# EAGLE design matrix mixer rev02 7eurorack (EAGLE 8.3.2)
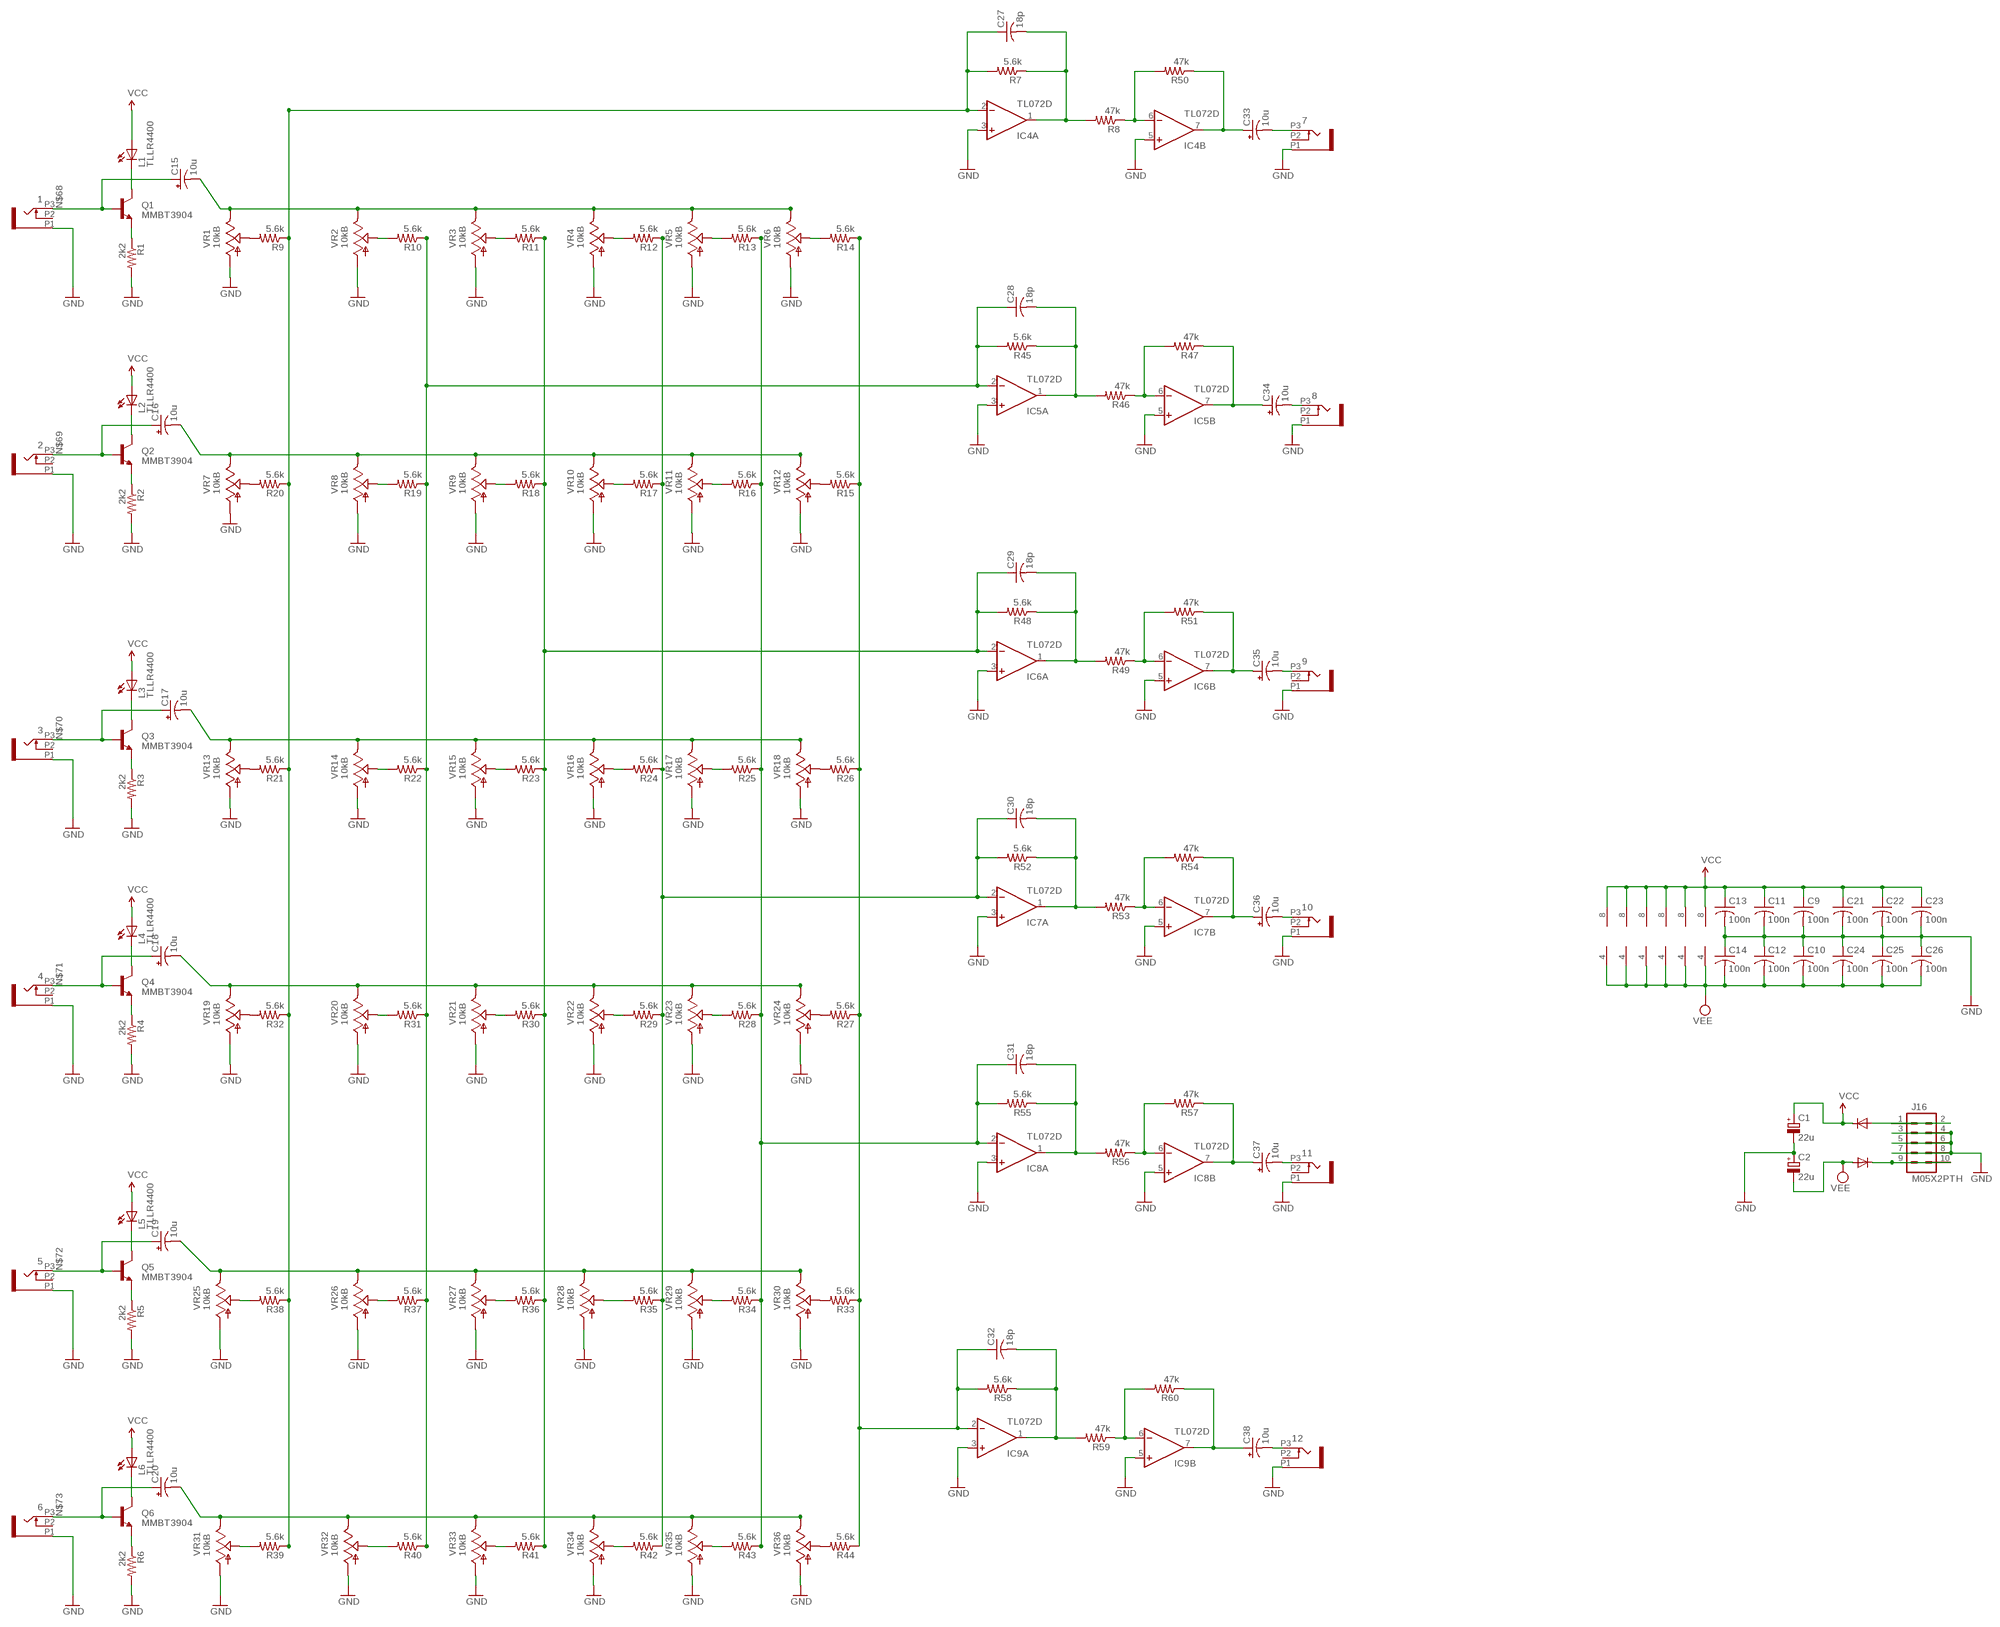
[diagram p0: schematic, sheet 1]

## Parts
1  PJ301_THONKICONN6  [WQP_PJ_301M6]
2  PJ301_THONKICONN6  [WQP_PJ_301M6]
3  PJ301_THONKICONN6  [WQP_PJ_301M6]
4  PJ301_THONKICONN6  [WQP_PJ_301M6]
5  PJ301_THONKICONN6  [WQP_PJ_301M6]
6  PJ301_THONKICONN6  [WQP_PJ_301M6]
7  PJ301_THONKICONN6  [WQP_PJ_301M6]
8  PJ301_THONKICONN6  [WQP_PJ_301M6]
9  PJ301_THONKICONN6  [WQP_PJ_301M6]
10  PJ301_THONKICONN6  [WQP_PJ_301M6]
11  PJ301_THONKICONN6  [WQP_PJ_301M6]
12  PJ301_THONKICONN6  [WQP_PJ_301M6]
C1  22u  CPOL-EUD  [PANASONIC_D]
C2  22u  CPOL-EUD  [PANASONIC_D]
C9  100n  C-USC0603  [C0603]
C10  100n  C-USC0603  [C0603]
C11  100n  C-USC0603  [C0603]
C12  100n  C-USC0603  [C0603]
C13  100n  C-USC0603  [C0603]
C14  100n  C-USC0603  [C0603]
C15  10u  CPOL-USB  [PANASONIC_B]
C16  10u  CPOL-USB  [PANASONIC_B]
C17  10u  CPOL-USB  [PANASONIC_B]
C18  10u  CPOL-USB  [PANASONIC_B]
C19  10u  CPOL-USB  [PANASONIC_B]
C20  10u  CPOL-USB  [PANASONIC_B]
C21  100n  C-USC0603  [C0603]
C22  100n  C-USC0603  [C0603]
C23  100n  C-USC0603  [C0603]
C24  100n  C-USC0603  [C0603]
C25  100n  C-USC0603  [C0603]
C26  100n  C-USC0603  [C0603]
C27  18p  C-USC0603  [C0603]
C28  18p  C-USC0603  [C0603]
C29  18p  C-USC0603  [C0603]
C30  18p  C-USC0603  [C0603]
C31  18p  C-USC0603  [C0603]
C32  18p  C-USC0603  [C0603]
C33  10u  CPOL-USB  [PANASONIC_B]
C34  10u  CPOL-USB  [PANASONIC_B]
C35  10u  CPOL-USB  [PANASONIC_B]
C36  10u  CPOL-USB  [PANASONIC_B]
C37  10u  CPOL-USB  [PANASONIC_B]
C38  10u  CPOL-USB  [PANASONIC_B]
D1  1N5819HW  DIODE-SOD123  [SOD123]
D2  1N5819HW  DIODE-SOD123  [SOD123]
IC4  TL072D  [SO08]
IC5  TL072D  [SO08]
IC6  TL072D  [SO08]
IC7  TL072D  [SO08]
IC8  TL072D  [SO08]
IC9  TL072D  [SO08]
J16  M05X2PTH  [AVR_ICSP]
L1  TLLR4400  [LED3MM]
L2  TLLR4400  [LED3MM]
L3  TLLR4400  [LED3MM]
L4  TLLR4400  [LED3MM]
L5  TLLR4400  [LED3MM]
L6  TLLR4400  [LED3MM]
Q1  MMBT3904  MMBT3904LT1-NPN-SOT23-BEC  [SOT23-BEC]
Q2  MMBT3904  MMBT3904LT1-NPN-SOT23-BEC  [SOT23-BEC]
Q3  MMBT3904  MMBT3904LT1-NPN-SOT23-BEC  [SOT23-BEC]
Q4  MMBT3904  MMBT3904LT1-NPN-SOT23-BEC  [SOT23-BEC]
Q5  MMBT3904  MMBT3904LT1-NPN-SOT23-BEC  [SOT23-BEC]
Q6  MMBT3904  MMBT3904LT1-NPN-SOT23-BEC  [SOT23-BEC]
R1  2k2  R-US_R0603  [R0603]
R2  2k2  R-US_R0603  [R0603]
R3  2k2  R-US_R0603  [R0603]
R4  2k2  R-US_R0603  [R0603]
R5  2k2  R-US_R0603  [R0603]
R6  2k2  R-US_R0603  [R0603]
R7  5.6k  R-US_R0603  [R0603]
R8  47k  R-US_R0603  [R0603]
R9  5.6k  R-US_R0603  [R0603]
R10  5.6k  R-US_R0603  [R0603]
R11  5.6k  R-US_R0603  [R0603]
R12  5.6k  R-US_R0603  [R0603]
R13  5.6k  R-US_R0603  [R0603]
R14  5.6k  R-US_R0603  [R0603]
R15  5.6k  R-US_R0603  [R0603]
R16  5.6k  R-US_R0603  [R0603]
R17  5.6k  R-US_R0603  [R0603]
R18  5.6k  R-US_R0603  [R0603]
R19  5.6k  R-US_R0603  [R0603]
R20  5.6k  R-US_R0603  [R0603]
R21  5.6k  R-US_R0603  [R0603]
R22  5.6k  R-US_R0603  [R0603]
R23  5.6k  R-US_R0603  [R0603]
R24  5.6k  R-US_R0603  [R0603]
R25  5.6k  R-US_R0603  [R0603]
R26  5.6k  R-US_R0603  [R0603]
R27  5.6k  R-US_R0603  [R0603]
R28  5.6k  R-US_R0603  [R0603]
R29  5.6k  R-US_R0603  [R0603]
R30  5.6k  R-US_R0603  [R0603]
R31  5.6k  R-US_R0603  [R0603]
R32  5.6k  R-US_R0603  [R0603]
R33  5.6k  R-US_R0603  [R0603]
R34  5.6k  R-US_R0603  [R0603]
R35  5.6k  R-US_R0603  [R0603]
R36  5.6k  R-US_R0603  [R0603]
R37  5.6k  R-US_R0603  [R0603]
R38  5.6k  R-US_R0603  [R0603]
R39  5.6k  R-US_R0603  [R0603]
R40  5.6k  R-US_R0603  [R0603]
R41  5.6k  R-US_R0603  [R0603]
R42  5.6k  R-US_R0603  [R0603]
R43  5.6k  R-US_R0603  [R0603]
R44  5.6k  R-US_R0603  [R0603]
R45  5.6k  R-US_R0603  [R0603]
R46  47k  R-US_R0603  [R0603]
R47  47k  R-US_R0603  [R0603]
R48  5.6k  R-US_R0603  [R0603]
R49  47k  R-US_R0603  [R0603]
R50  47k  R-US_R0603  [R0603]
R51  47k  R-US_R0603  [R0603]
R52  5.6k  R-US_R0603  [R0603]
R53  47k  R-US_R0603  [R0603]
R54  47k  R-US_R0603  [R0603]
R55  5.6k  R-US_R0603  [R0603]
R56  47k  R-US_R0603  [R0603]
R57  47k  R-US_R0603  [R0603]
R58  5.6k  R-US_R0603  [R0603]
R59  47k  R-US_R0603  [R0603]
R60  47k  R-US_R0603  [R0603]
VR1  10kB  POT_USVERTICAL_PS  [ALPS_POT_VERTICAL_PS]
VR2  10kB  POT_USVERTICAL_PS  [ALPS_POT_VERTICAL_PS]
VR3  10kB  POT_USVERTICAL_PS  [ALPS_POT_VERTICAL_PS]
VR4  10kB  POT_USVERTICAL_PS  [ALPS_POT_VERTICAL_PS]
VR5  10kB  POT_USVERTICAL_PS  [ALPS_POT_VERTICAL_PS]
VR6  10kB  POT_USVERTICAL_PS  [ALPS_POT_VERTICAL_PS]
VR7  10kB  POT_USVERTICAL_PS  [ALPS_POT_VERTICAL_PS]
VR8  10kB  POT_USVERTICAL_PS  [ALPS_POT_VERTICAL_PS]
VR9  10kB  POT_USVERTICAL_PS  [ALPS_POT_VERTICAL_PS]
VR10  10kB  POT_USVERTICAL_PS  [ALPS_POT_VERTICAL_PS]
VR11  10kB  POT_USVERTICAL_PS  [ALPS_POT_VERTICAL_PS]
VR12  10kB  POT_USVERTICAL_PS  [ALPS_POT_VERTICAL_PS]
VR13  10kB  POT_USVERTICAL_PS  [ALPS_POT_VERTICAL_PS]
VR14  10kB  POT_USVERTICAL_PS  [ALPS_POT_VERTICAL_PS]
VR15  10kB  POT_USVERTICAL_PS  [ALPS_POT_VERTICAL_PS]
VR16  10kB  POT_USVERTICAL_PS  [ALPS_POT_VERTICAL_PS]
VR17  10kB  POT_USVERTICAL_PS  [ALPS_POT_VERTICAL_PS]
VR18  10kB  POT_USVERTICAL_PS  [ALPS_POT_VERTICAL_PS]
VR19  10kB  POT_USVERTICAL_PS  [ALPS_POT_VERTICAL_PS]
VR20  10kB  POT_USVERTICAL_PS  [ALPS_POT_VERTICAL_PS]
VR21  10kB  POT_USVERTICAL_PS  [ALPS_POT_VERTICAL_PS]
VR22  10kB  POT_USVERTICAL_PS  [ALPS_POT_VERTICAL_PS]
VR23  10kB  POT_USVERTICAL_PS  [ALPS_POT_VERTICAL_PS]
VR24  10kB  POT_USVERTICAL_PS  [ALPS_POT_VERTICAL_PS]
VR25  10kB  POT_USVERTICAL_PS  [ALPS_POT_VERTICAL_PS]
VR26  10kB  POT_USVERTICAL_PS  [ALPS_POT_VERTICAL_PS]
VR27  10kB  POT_USVERTICAL_PS  [ALPS_POT_VERTICAL_PS]
VR28  10kB  POT_USVERTICAL_PS  [ALPS_POT_VERTICAL_PS]
VR29  10kB  POT_USVERTICAL_PS  [ALPS_POT_VERTICAL_PS]
VR30  10kB  POT_USVERTICAL_PS  [ALPS_POT_VERTICAL_PS]
VR31  10kB  POT_USVERTICAL_PS  [ALPS_POT_VERTICAL_PS]
VR32  10kB  POT_USVERTICAL_PS  [ALPS_POT_VERTICAL_PS]
VR33  10kB  POT_USVERTICAL_PS  [ALPS_POT_VERTICAL_PS]
VR34  10kB  POT_USVERTICAL_PS  [ALPS_POT_VERTICAL_PS]
VR35  10kB  POT_USVERTICAL_PS  [ALPS_POT_VERTICAL_PS]
VR36  10kB  POT_USVERTICAL_PS  [ALPS_POT_VERTICAL_PS]

## Nets
GND: 1.P1 2.P1 3.P1 4.P1 5.P1 6.P1 7.P1 8.P1 9.P1 10.P1 11.P1 12.P1 C1.- C2.+ C9.2 C10.1 C11.2 C12.1 C13.2 C14.1 C21.2 C22.2 C23.2 C24.1 C25.1 C26.1 IC4.3(A:+IN) IC4.5(B:+IN) IC5.3(A:+IN) IC5.5(B:+IN) IC6.3(A:+IN) IC6.5(B:+IN) IC7.3(A:+IN) IC7.5(B:+IN) IC8.3(A:+IN) IC8.5(B:+IN) IC9.3(A:+IN) IC9.5(B:+IN) J16.3 J16.4 J16.5 J16.6 J16.7 J16.8 R1.2 R2.2 R3.2 R4.2 R5.2 R6.2 VR1.P$3(A) VR2.P$3(A) VR3.P$3(A) VR4.P$3(A) VR5.P$3(A) VR6.P$3(A) VR7.P$3(A) VR8.P$3(A) VR9.P$3(A) VR10.P$3(A) VR11.P$3(A) VR12.P$3(A) VR13.P$3(A) VR14.P$3(A) VR15.P$3(A) VR16.P$3(A) VR17.P$3(A) VR18.P$3(A) VR19.P$3(A) VR20.P$3(A) VR21.P$3(A) VR22.P$3(A) VR23.P$3(A) VR24.P$3(A) VR25.P$3(A) VR26.P$3(A) VR27.P$3(A) VR28.P$3(A) VR29.P$3(A) VR30.P$3(A) VR31.P$3(A) VR32.P$3(A) VR33.P$3(A) VR34.P$3(A) VR35.P$3(A) VR36.P$3(A)
INPUT_1: C15.- VR1.P$1(E) VR2.P$1(E) VR3.P$1(E) VR4.P$1(E) VR5.P$1(E) VR6.P$1(E)
INPUT_2: C16.- VR7.P$1(E) VR8.P$1(E) VR9.P$1(E) VR10.P$1(E) VR11.P$1(E) VR12.P$1(E)
INPUT_3: C17.- VR13.P$1(E) VR14.P$1(E) VR15.P$1(E) VR16.P$1(E) VR17.P$1(E) VR18.P$1(E)
INPUT_4: C18.- VR19.P$1(E) VR20.P$1(E) VR21.P$1(E) VR22.P$1(E) VR23.P$1(E) VR24.P$1(E)
INPUT_5: C19.- VR25.P$1(E) VR26.P$1(E) VR27.P$1(E) VR28.P$1(E) VR29.P$1(E) VR30.P$1(E)
INPUT_6: C20.- VR31.P$1(E) VR32.P$1(E) VR33.P$1(E) VR34.P$1(E) VR35.P$1(E) VR36.P$1(E)
N$1: R9.2 VR1.P$2(S)
N$2: Q2.E R2.1
N$3: Q1.E R1.1
N$4: R10.2 VR2.P$2(S)
N$5: R11.2 VR3.P$2(S)
N$6: 12.P3 C38.-
N$7: L2.K(C) Q2.C
N$8: L1.K(C) Q1.C
N$9: R12.2 VR4.P$2(S)
N$10: R13.2 VR5.P$2(S)
N$11: R14.2 VR6.P$2(S)
N$12: L4.K(C) Q4.C
N$13: R15.2 VR12.P$2(S)
N$14: R16.2 VR11.P$2(S)
N$15: L3.K(C) Q3.C
N$16: R17.2 VR10.P$2(S)
N$17: R18.2 VR9.P$2(S)
N$18: R19.2 VR8.P$2(S)
N$19: R20.2 VR7.P$2(S)
N$20: Q4.E R4.1
N$21: R21.2 VR13.P$2(S)
N$22: R22.2 VR14.P$2(S)
N$23: R23.2 VR15.P$2(S)
N$24: R24.2 VR16.P$2(S)
N$25: R25.2 VR17.P$2(S)
N$26: R26.2 VR18.P$2(S)
N$27: Q3.E R3.1
N$28: R27.2 VR24.P$2(S)
N$29: L6.K(C) Q6.C
N$30: L5.K(C) Q5.C
N$31: Q6.E R6.1
N$32: Q5.E R5.1
N$33: 11.P3 C37.-
N$34: 10.P3 C36.-
N$35: 9.P3 C35.-
N$36: 8.P3 C34.-
N$37: 7.P3 C33.-
N$38: R28.2 VR23.P$2(S)
N$39: R29.2 VR22.P$2(S)
N$40: R30.2 VR21.P$2(S)
N$41: R31.2 VR20.P$2(S)
N$42: R32.2 VR19.P$2(S)
N$43: R33.2 VR30.P$2(S)
N$44: D1.A J16.1 J16.2
N$45: R34.2 VR29.P$2(S)
N$46: D2.C J16.9 J16.10
N$50: R35.2 VR28.P$2(S)
N$51: R36.2 VR27.P$2(S)
N$52: R37.2 VR26.P$2(S)
N$53: R38.2 VR25.P$2(S)
N$54: R39.2 VR31.P$2(S)
N$55: R40.2 VR32.P$2(S)
N$56: R41.2 VR33.P$2(S)
N$57: R42.2 VR34.P$2(S)
N$60: R43.2 VR35.P$2(S)
N$61: R44.2 VR36.P$2(S)
N$62: C27.1 IC4.2(A:-IN) R7.2 R9.1 R20.1 R21.1 R32.1 R38.1 R39.1
N$63: C28.1 IC5.2(A:-IN) R10.1 R19.1 R22.1 R31.1 R37.1 R40.1 R45.2
N$64: C29.1 IC6.2(A:-IN) R11.1 R18.1 R23.1 R30.1 R36.1 R41.1 R48.2
N$65: C30.1 IC7.2(A:-IN) R12.1 R17.1 R24.1 R29.1 R35.1 R42.1 R52.2
N$66: C31.1 IC8.2(A:-IN) R13.1 R16.1 R25.1 R28.1 R34.1 R43.1 R55.2
N$67: C32.1 IC9.2(A:-IN) R14.1 R15.1 R26.1 R27.1 R33.1 R44.1 R58.2
N$68: 1.P3 C15.+ Q1.B
N$69: 2.P3 C16.+ Q2.B
N$70: 3.P3 C17.+ Q3.B
N$71: 4.P3 C18.+ Q4.B
N$72: 5.P3 C19.+ Q5.B
N$73: 6.P3 C20.+ Q6.B
N$74: C27.2 IC4.1(A:OUT) R7.1 R8.2
N$75: IC4.6(B:-IN) R8.1 R50.2
N$76: C33.+ IC4.7(B:OUT) R50.1
N$78: C28.2 IC5.1(A:OUT) R45.1 R46.2
N$79: IC5.6(B:-IN) R46.1 R47.2
N$80: C34.+ IC5.7(B:OUT) R47.1
N$83: C29.2 IC6.1(A:OUT) R48.1 R49.2
N$84: IC6.6(B:-IN) R49.1 R51.2
N$85: C35.+ IC6.7(B:OUT) R51.1
N$86: C30.2 IC7.1(A:OUT) R52.1 R53.2
N$87: IC7.6(B:-IN) R53.1 R54.2
N$88: C36.+ IC7.7(B:OUT) R54.1
N$90: C31.2 IC8.1(A:OUT) R55.1 R56.2
N$91: IC8.6(B:-IN) R56.1 R57.2
N$92: C37.+ IC8.7(B:OUT) R57.1
N$94: C32.2 IC9.1(A:OUT) R58.1 R59.2
N$95: IC9.6(B:-IN) R59.1 R60.2
N$96: C38.+ IC9.7(B:OUT) R60.1
VCC: C1.+ C9.1 C11.1 C13.1 C21.1 C22.1 C23.1 D1.C IC4.8(P:V+) IC5.8(P:V+) IC6.8(P:V+) IC7.8(P:V+) IC8.8(P:V+) IC9.8(P:V+) L1.A L2.A L3.A L4.A L5.A L6.A
VEE: C2.- C10.2 C12.2 C14.2 C24.2 C25.2 C26.2 D2.A IC4.4(P:V-) IC5.4(P:V-) IC6.4(P:V-) IC7.4(P:V-) IC8.4(P:V-) IC9.4(P:V-)
Unconnected: 1.P2 2.P2 3.P2 4.P2 5.P2 6.P2 7.P2 8.P2 9.P2 10.P2 11.P2 12.P2

## Library data of the parts
1-12 = og-pj301:PJ301_THONKICONN
C1 C2 = rcl:CPOL-EU: POLARIZED CAPACITOR, European symbol
C9-C14 C21-C32 = rcl:C-US: CAPACITOR, American symbol
C15-C20 C33-C38 = rcl:CPOL-US: POLARIZED CAPACITOR, American symbol
D1 D2 = diode:DIODE-: DIODE
IC4-IC9 = linear:TL072: OP AMP
J16 = og-header:M05X2: Header 5x2 Standard 10-pin dual row 0.1" header. Commonly used with AVR-ISP. Use with Spark Fun Electronics SKU: PRT-00778
L1-L6 = led:TLLR4400: Low Current (2mA) LED 3 mm Tinted Diffused Package color RED Source: Data sheet <http://www.farnell.com/datasheets/391100.pdf>; MF: VISHAY SEMICONDUCTOR; OC_FARNELL: 1612437
Q1-Q6 = transistor:*-NPN-: NPN Transistror BF959 corrected 2008.03.06
R1-R60 = rcl:R-US_: RESISTOR, American symbol
VR1-VR36 = pot-alps:POT_US

## Board
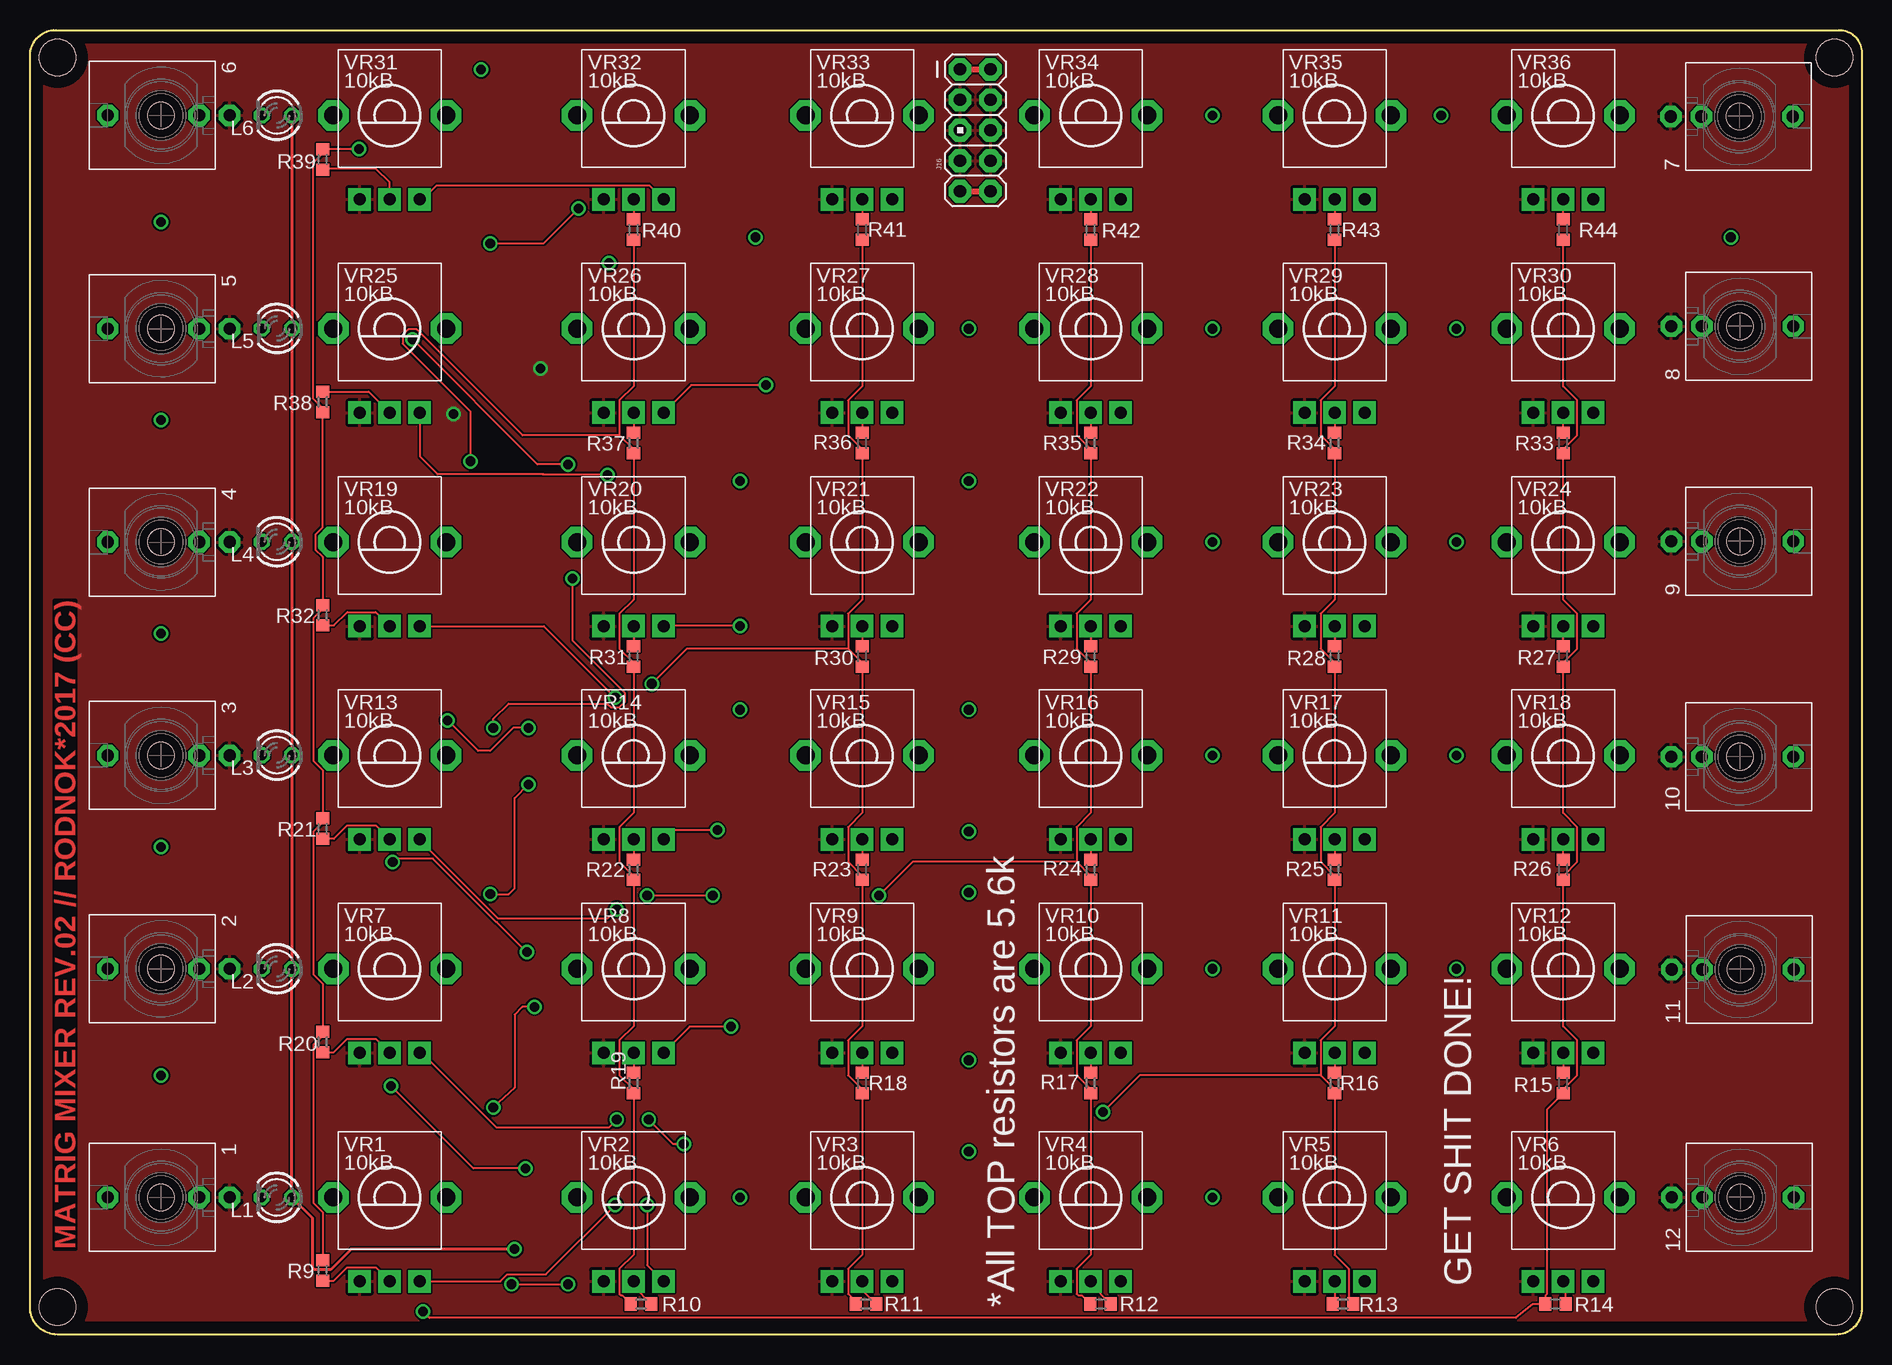
[diagram p1: board, top side]
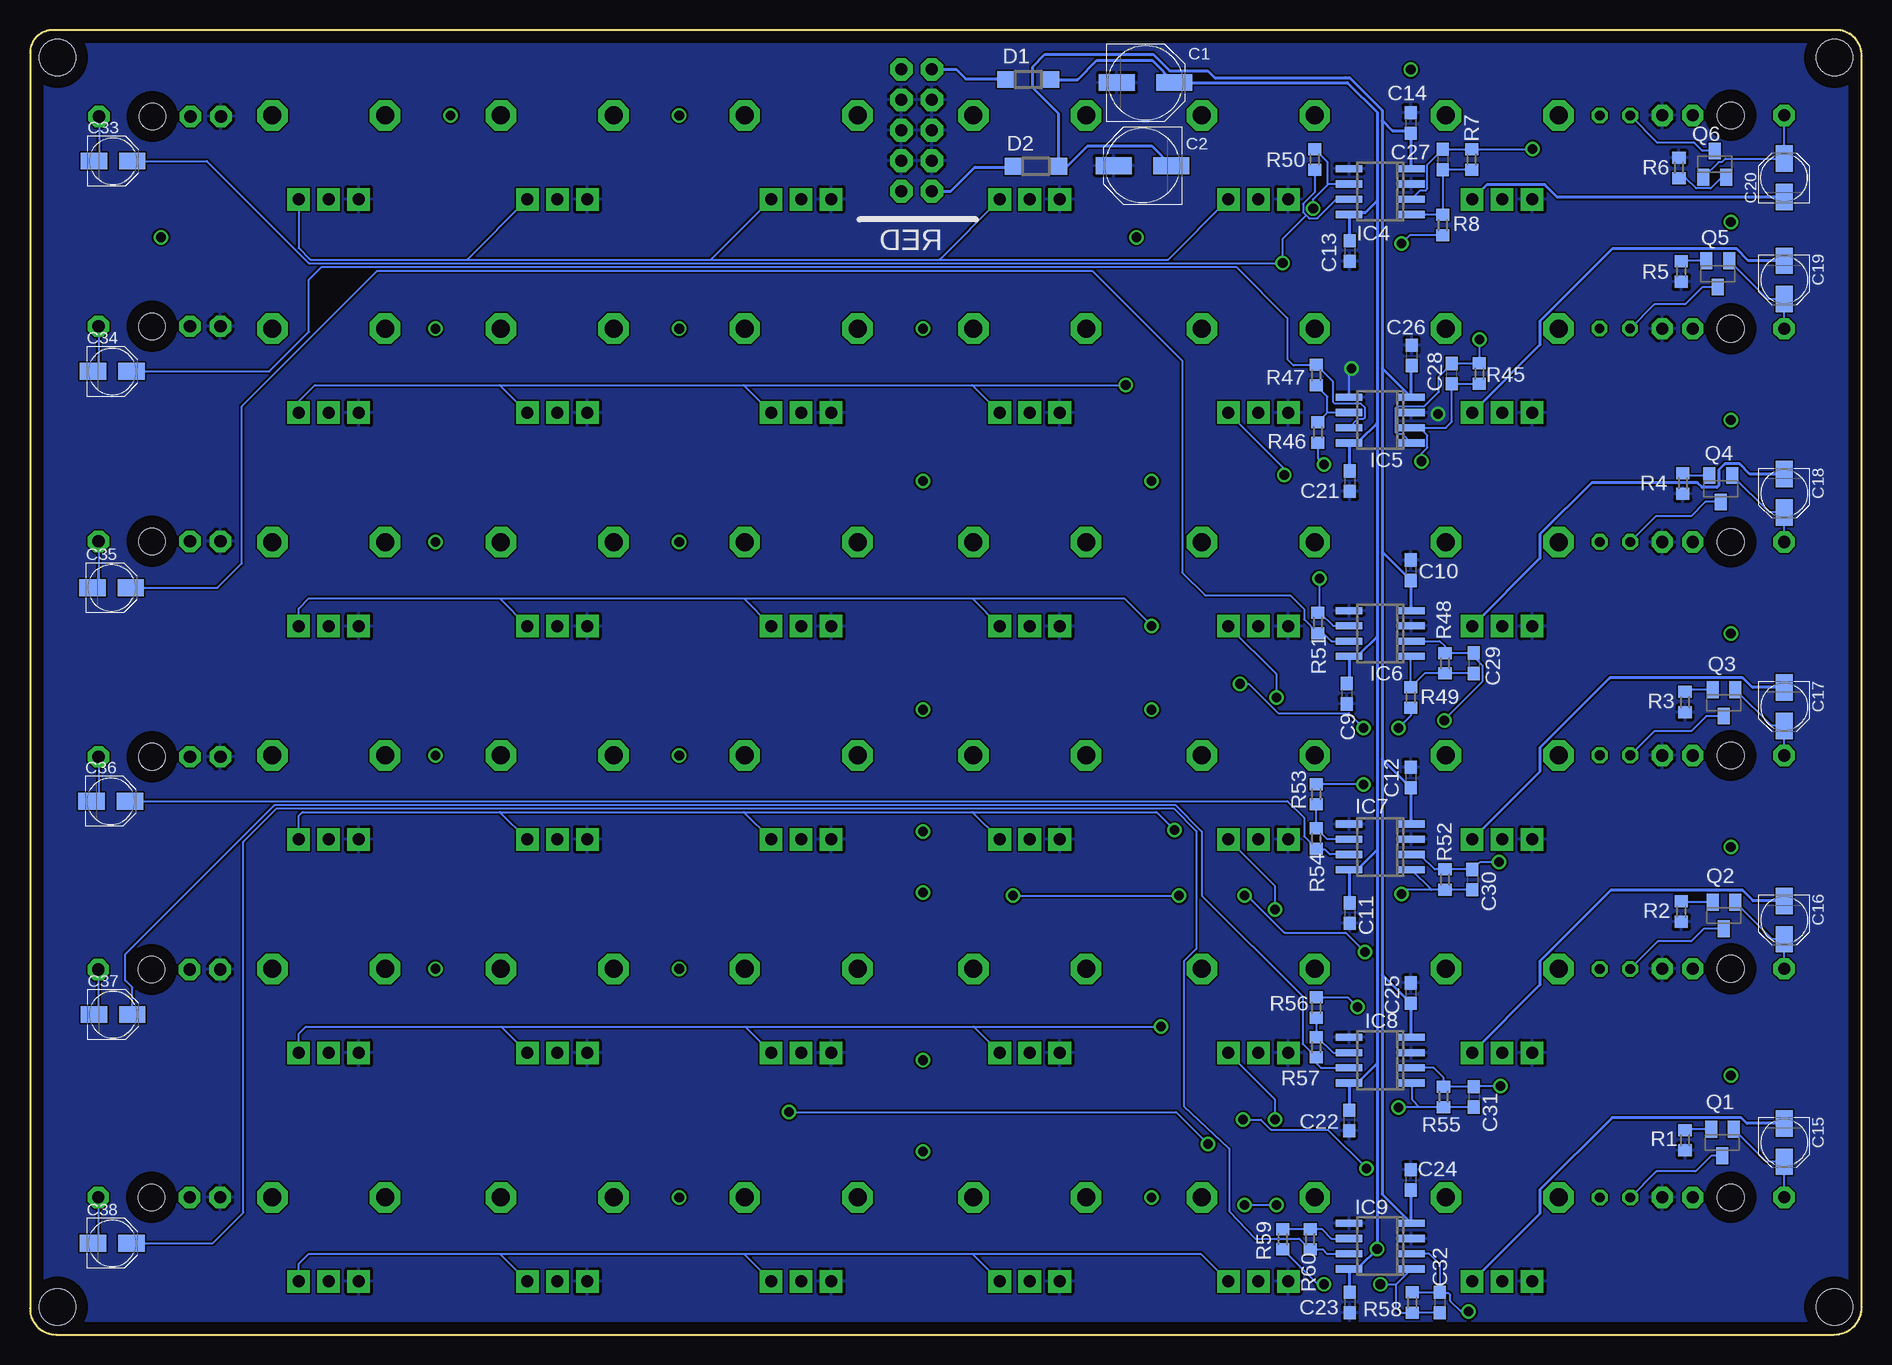
[diagram p2: board, bottom side, seen from below]

Size 152.65 x 108.71 mm. Coordinates in mm from the lower left corner, seen from the top.
Outline: 2.29,0 arc-90 0,2.29 0,106.55 arc-90 2.16,108.71 150.75,108.71 arc-90 152.65,106.81 152.65,2.16 arc-90 150.5,0 2.29,0
Copper layers (1*16): Top 0.035mm / dielectric 1.5mm / Bottom 0.035mm
Design rules "default": minimum track width 6mil, minimum drill 0.35mm, track to track 6mil, track to pad 6mil, pad to pad 6mil, via to via 6mil, smd to smd 6mil, copper to edge 40mil, drill to drill 6mil, minimum pad ring 10mil, minimum via ring 8mil, stop-mask expansion 4mil, vias tented up to drill 0mil, thermal gap 10mil
Holes 3 mm at 2.29,106.43 2.29,2.29 150.37,2.29 150.37,106.43

### Footprints (pad centres in the part's own frame; a part is rotated, then mirrored left to right if it is on the bottom)
WQP_PJ_301M6 = drill 1.016 pad 1.778 octagon: P1 0,-5.715; P2 0,-3.175; P3 0,4.445 | hole 2.2: 0,0
PANASONIC_D = smd 3 x 1.4: + 2.4,0; - -2.4,0
C0603 = smd 1.1 x 1: 1 -0.85,0; 2 0.85,0
PANASONIC_B = smd 2.2 x 1.4: + 1.6,0; - -1.6,0
SOD123 = smd 1.4 x 1.4: A 1.9,0; C -1.9,0
SO08 = smd 0.6 x 2.2: 1 -1.905,-2.6; 2 -0.635,-2.6; 3 0.635,-2.6; 4 1.905,-2.6; 5 1.905,2.6; 6 0.635,2.6; 7 -0.635,2.6; 8 -1.905,2.6
AVR_ICSP = drill 1.016 pad 1.88 octagon: 1 -1.27,5.08; 2 1.27,5.08; 3 -1.27,2.54; 4 1.27,2.54; 5 -1.27,0; 6 1.27,0; 7 -1.27,-2.54; 8 1.27,-2.54; 9 -1.27,-5.08; 10 1.27,-5.08
LED3MM = drill 0.813 octagon: A -1.27,0; K 1.27,0
SOT23-BEC = smd 1 x 1.4: B -0.95,-1.1; C 0,1.1; E 0.95,-1.1
R0603 = smd 1 x 1.1: 1 -0.85,0; 2 0.85,0
ALPS_POT_VERTICAL_PS = drill 1 pad 1.88 square: P$1 -2.5,7; P$2 0,7; P$3 2.5,7 | drill 1.5 pad 2.54 octagon: P$4 -4.7,0; P$5 4.7,0

### Placement (x,y rotation side)
1  10.92,11.43 90 top
2  10.92,30.48 90 top
3  10.92,48.26 90 top
4  10.92,66.04 90 top
5  10.92,83.82 90 top
6  10.92,101.6 90 top
7  142.46,101.51 270 top
8  142.5,84.02 270 top
9  142.5,66.1 270 top
10  142.5,48.15 270 top
11  142.53,30.42 270 top
12  142.53,11.43 270 top
C1  59.69,104.33 0 bottom
C2  59.94,97.41 180 bottom
C9  42.93,53.4 270 bottom
C10  37.59,63.69 270 bottom
C11  42.67,35.12 270 bottom
C12  37.59,46.42 270 bottom
C13  42.67,90.3 270 bottom
C14  37.59,100.96 270 bottom
C15  6.48,16 270 bottom
C16  6.48,34.54 270 bottom
C17  6.48,52.32 270 bottom
C18  6.48,70.1 270 bottom
C19  6.48,87.88 270 bottom
C20  6.48,96.39 90 bottom
C21  42.67,71.12 270 bottom
C22  42.74,17.84 270 bottom
C23  42.67,2.67 270 bottom
C24  37.59,12.89 270 bottom
C25  37.59,28.45 270 bottom
C26  37.53,81.6 270 bottom
C27  34.93,97.92 270 bottom
C28  34.16,80.07 90 bottom
C29  32.32,55.94 270 bottom
C30  32.45,37.91 270 bottom
C31  32.32,19.81 270 bottom
C32  35.18,2.67 270 bottom
C33  145.73,97.79 0 bottom
C34  145.8,80.26 0 bottom
C35  145.86,62.23 0 bottom
C36  145.92,44.45 0 bottom
C37  145.73,26.67 0 bottom
C38  145.8,7.62 0 bottom
D1  69.47,104.58 180 bottom
D2  68.83,97.35 0 bottom
IC4  40.13,95.25 90 bottom
IC5  40.13,76.2 90 bottom
IC6  40.13,58.42 90 bottom
IC7  40.13,40.64 90 bottom
IC8  40.13,22.86 90 bottom
IC9  40.13,7.37 90 bottom
J16  78.78,100.36 0 top
L1  20.56,11.42 180 top
L2  20.57,30.47 180 top
L3  20.57,48.27 180 top
L4  20.57,66.05 180 top
L5  20.59,83.83 180 top
L6  20.57,101.59 180 top
Q1  11.62,16 180 bottom
Q2  11.49,34.93 180 bottom
Q3  11.49,52.64 180 bottom
Q4  11.75,70.48 180 bottom
Q5  12,88.39 180 bottom
Q6  12.26,97.54 0 bottom
R1  14.73,16.19 270 bottom
R2  15.05,35.24 270 bottom
R3  14.73,52.71 270 bottom
R4  14.92,70.93 270 bottom
R5  15.05,88.58 270 bottom
R6  15.24,97.22 90 bottom
R7  32.51,97.92 90 bottom
R8  34.93,92.46 90 bottom
R9  24.38,5.33 270 top
R10  50.93,2.54 0 top
R11  69.66,2.54 0 top
R12  89.22,2.54 0 top
R13  109.41,2.54 180 top
R14  127.13,2.54 0 top
R15  127.76,20.95 90 top
R16  108.71,20.95 90 top
R17  88.39,20.95 90 top
R18  69.34,20.95 90 top
R19  50.29,20.95 90 top
R20  24.38,24.38 270 top
R21  24.38,42.16 270 top
R22  50.29,38.74 90 top
R23  69.34,38.74 90 top
R24  88.39,38.74 90 top
R25  108.71,38.74 90 top
R26  127.76,38.74 90 top
R27  127.76,56.52 90 top
R28  108.71,56.52 90 top
R29  88.39,56.52 90 top
R30  69.34,56.52 90 top
R31  50.29,56.52 90 top
R32  24.38,59.94 270 top
R33  127.76,74.3 90 top
R34  108.71,74.3 90 top
R35  88.39,74.3 90 top
R36  69.34,74.3 90 top
R37  50.29,74.3 90 top
R38  24.38,77.72 90 top
R39  24.38,97.92 270 top
R40  50.29,92.08 90 top
R41  69.34,92.08 90 top
R42  88.39,92.08 90 top
R43  108.71,92.08 90 top
R44  127.76,92.08 90 top
R45  31.88,80.07 270 bottom
R46  45.34,75.18 270 bottom
R47  45.47,79.95 270 bottom
R48  34.73,55.94 90 bottom
R49  37.59,53.09 90 bottom
R50  45.59,97.92 90 bottom
R51  45.34,59.31 90 bottom
R52  34.73,37.91 90 bottom
R53  45.47,45.02 90 bottom
R54  45.47,41.34 90 bottom
R55  34.86,19.81 90 bottom
R56  45.47,27.24 90 bottom
R57  45.47,23.94 90 bottom
R58  37.47,2.67 90 bottom
R59  48.26,7.94 270 bottom
R60  45.97,7.94 90 bottom
VR1  29.97,11.43 180 top
VR2  50.29,11.43 180 top
VR3  69.34,11.43 180 top
VR4  88.39,11.43 180 top
VR5  108.71,11.43 180 top
VR6  127.76,11.43 180 top
VR7  29.97,30.48 180 top
VR8  50.29,30.48 180 top
VR9  69.34,30.48 180 top
VR10  88.39,30.48 180 top
VR11  108.71,30.48 180 top
VR12  127.76,30.48 180 top
VR13  29.97,48.26 180 top
VR14  50.29,48.26 180 top
VR15  69.34,48.26 180 top
VR16  88.39,48.26 180 top
VR17  108.71,48.26 180 top
VR18  127.76,48.26 180 top
VR19  29.97,66.04 180 top
VR20  50.29,66.04 180 top
VR21  69.34,66.04 180 top
VR22  88.39,66.04 180 top
VR23  108.71,66.04 180 top
VR24  127.76,66.04 180 top
VR25  29.97,83.82 180 top
VR26  50.29,83.82 180 top
VR27  69.34,83.82 180 top
VR28  88.39,83.82 180 top
VR29  108.71,83.82 180 top
VR30  127.76,83.82 180 top
VR31  29.97,101.6 180 top
VR32  50.29,101.6 180 top
VR33  69.34,101.6 180 top
VR34  88.39,101.6 180 top
VR35  108.71,101.6 180 top
VR36  127.76,101.6 180 top

### Tracks (layer width: path | path; a pad name or v marks a point on that pad's centre or on a via)
GND  (via drill 0.8 pad 0.8)
  Bottom 0.152: IC5.5 42.73,80.33 v42.55,80.52 | 35.43,76.83 v35.31,76.71
  pour Top: -1.02,-1.52 -1.02,110.87 154.18,110.87 154.18,-2.41 -1.02,-2.41 -1.02,-1.65
  pour Bottom: -2.03,0.51 -0.38,110.11 153.42,110.11 153.42,-1.27 -2.03,-1.27
INPUT_1  (via drill 0.8 pad 0.8)
  Top 0.152: VR1.P$1 39.2,4.43 39.79,5.02 43,5.02 v48.77,10.79 | v51.44,10.79 51.44,5.79 VR2.P$1
  Bottom 0.152: VR6.P$1 130.26,5.88 129.41,6.73 113.51,6.73 | 113.51,6.73 VR5.P$1 | 113.51,6.73 93.19,6.73 | 93.19,6.73 VR4.P$1 | 93.19,6.73 74.14,6.73 | 74.14,6.73 VR3.P$1 | 74.14,6.73 55.09,6.73 VR2.P$1 | v48.77,10.79 v51.44,10.79
  Bottom 0.254: C15.- 9.57,17.6 10.05,18.08 20.81,18.08 26.82,12.07 26.82,10.08 VR1.P$1
INPUT_2  (via drill 0.8 pad 0.8)
  Top 0.152: v58.42,25.65 54.97,25.65 VR8.P$1 | VR7.P$1 32.65,23.48 38.86,17.27 48.26,17.27 v48.9,17.91
  Bottom 0.152: VR12.P$1 130.26,25.06 129.67,25.65 113.39,25.65 | 113.39,25.65 VR11.P$1 | 113.39,25.65 93.07,25.65 | 93.07,25.65 VR10.P$1 | 93.07,25.65 74.02,25.65 | 74.02,25.65 VR9.P$1 | 74.02,25.65 v58.42,25.65 | v48.9,17.91 48.9,19.58 VR8.P$1
  Bottom 0.254: C16.- 9.07,36.14 9.93,37 20.94,37 26.82,31.12 26.82,29.13 VR7.P$1
INPUT_3  (via drill 0.8 pad 0.8)
  Top 0.152: v57.28,42.04 53.57,42.04 VR14.P$1 | VR13.P$1 32.47,41.19 38.99,34.67 48.13,34.67 v48.9,35.43
  Bottom 0.152: VR18.P$1 130.26,43.22 129.95,43.54 113.49,43.54 | 113.49,43.54 VR17.P$1 | 113.49,43.54 93.17,43.54 | 93.17,43.54 VR16.P$1 | 93.17,43.54 74.12,43.54 | 74.12,43.54 VR15.P$1 | 74.12,43.54 58.78,43.54 v57.28,42.04 | v48.9,35.43 48.9,37.36 VR14.P$1
  Bottom 0.254: C17.- 9.13,53.92 9.93,54.72 21,54.72 26.82,48.9 26.82,46.91 VR13.P$1
INPUT_4  (via drill 0.8 pad 0.8)
  Top 0.152: v59.18,59.05 52.81,59.05 VR20.P$1 | VR19.P$1 42.81,59.04 v48.77,53.09
  Bottom 0.152: VR24.P$1 130.26,60.49 129.41,61.34 113.51,61.34 | 113.51,61.34 VR23.P$1 | 113.51,61.34 93.19,61.34 | 93.19,61.34 VR22.P$1 | 93.19,61.34 74.14,61.34 | 74.14,61.34 VR21.P$1 | 74.14,61.34 61.47,61.34 v59.18,59.05 | v48.77,53.09 48.77,55.02 VR20.P$1
  Bottom 0.254: C18.- 9.32,71.7 10.18,72.56 11.41,72.56 11.92,72.06 11.92,70.77 12.08,70.61 13.31,70.61 13.71,71 22.5,71 26.82,66.68 26.82,64.69 VR19.P$1
INPUT_5  (via drill 0.8 pad 0.8)
  Top 0.152: v61.34,79.12 55.09,79.12 VR26.P$1 | v48.13,71.63 48.08,71.69 42.8,71.69 | 42.69,71.69 42.8,71.69 | 42.8,71.69 33.98,71.69 32.51,73.15 32.51,76.78 VR25.P$1
  Bottom 0.152: VR30.P$1 130.26,77.76 128.91,79.12 113.51,79.12 | 113.51,79.12 VR29.P$1 | 113.51,79.12 93.19,79.12 | 93.19,79.12 VR28.P$1 | 93.19,79.12 74.14,79.12 | 74.14,79.12 VR27.P$1 | 74.14,79.12 v61.34,79.12 | v48.13,71.63 48.13,72.16 VR26.P$1
  Bottom 0.254: C19.- 9.45,89.48 10.44,90.47 20.81,90.47 26.82,84.46 26.82,82.47 VR25.P$1
INPUT_6
  Top 0.152: VR31.P$1 32.75,94.6 33.91,95.76 46.75,95.76 46.76,95.77 51.62,95.77 VR32.P$1
  Bottom 0.152: VR36.P$1 130.26,90.56 129.29,89.59 116.23,89.59 | 116.23,89.59 VR35.P$1 | 116.23,89.59 95.91,89.59 | 95.91,89.59 VR34.P$1 | 95.91,89.59 76.86,89.59 | 76.86,89.59 VR33.P$1 | 76.86,89.59 57.81,89.59 VR32.P$1
  Bottom 0.254: C20.- 25.39,94.79 26.42,95.82 31.25,95.82 VR31.P$1
N$1
  Top 0.152: R9.2 25.32,4.48 26.44,5.6 28.8,5.6 VR1.P$2
N$2
  Bottom 0.152: Q2.E 14.98,36.03 R2.1
N$3
  Bottom 0.152: Q1.E 14.67,17.1 R1.1
N$4
  Top 0.152: VR2.P$2 50.29,4.03 R10.2
N$5
  Top 0.152: VR3.P$2 69.34,3.71 R11.2
N$6
  Bottom 0.152: 12.P3 146.97,8.04 C38.-
N$7
  Bottom 0.152: Q2.C 13.16,33.83 14.22,32.77 17.01,32.77 L2.K
N$8
  Bottom 0.152: Q1.C 12.53,14.9 13.84,13.59 17.12,13.59 L1.K
N$9
  Top 0.152: VR4.P$2 88.39,4.22 R12.2
N$10
  Top 0.152: VR5.P$2 108.71,2.69 R13.2
N$11
  Top 0.152: R14.2 127.98,4.21 VR6.P$2
N$12
  Bottom 0.152: Q4.C 13.04,69.38 14.22,68.2 17.16,68.2 L4.K
N$13
  Top 0.152: VR12.P$2 R15.2
N$14
  Top 0.152: VR11.P$2 R16.2
N$15
  Bottom 0.152: Q3.C 12.97,51.54 14.22,50.29 17.29,50.29 L3.K
N$16
  Top 0.152: VR10.P$2 R17.2
N$17
  Top 0.152: VR9.P$2 R18.2
N$18
  Top 0.152: VR8.P$2 R19.2
N$19
  Top 0.152: R20.2 25.32,23.53 26.44,24.65 28.8,24.65 VR7.P$2
N$20
  Bottom 0.152: Q4.E 14.73,71.58 R4.1
N$21
  Top 0.152: R21.2 25.32,41.31 26.44,42.43 28.8,42.43 VR13.P$2
N$22
  Top 0.152: VR14.P$2 R22.2
N$23
  Top 0.152: VR15.P$2 R23.2
N$24
  Top 0.152: VR16.P$2 R24.2
N$25
  Top 0.152: VR17.P$2 R25.2
N$26
  Top 0.152: R26.2 VR18.P$2
N$27
  Bottom 0.152: Q3.E 14.54,53.74 R3.1
N$28
  Top 0.152: R27.2 VR24.P$2
N$29
  Bottom 0.152: Q6.C 13.29,98.64 13.97,99.31 17.03,99.31 L6.K
N$30
  Bottom 0.152: Q5.C 13.29,87.29 14.73,85.85 17.3,85.85 L5.K
N$31
  Bottom 0.152: Q6.E 11.68,96.44 12.61,95.51 13.8,95.51 14.66,96.37 R6.1
N$32
  Bottom 0.152: Q5.E 14.99,89.49 R5.1
N$33
  Bottom 0.152: 11.P3 146.97,27.03 C37.-
N$34
  Bottom 0.152: 10.P3 146.94,45.03 C36.-
N$35
  Bottom 0.152: 9.P3 146.94,62.99 147.19,62.74 147.19,62.5 C35.-
N$36
  Bottom 0.152: 8.P3 146.94,80.72 C34.-
N$37
  Bottom 0.152: 7.P3 146.9,98.22 C33.-
N$38
  Top 0.152: VR23.P$2 R28.2
N$39
  Top 0.152: VR22.P$2 R29.2
N$40
  Top 0.152: VR21.P$2 R30.2
N$41
  Top 0.152: VR20.P$2 R31.2
N$42
  Top 0.152: R32.2 25.32,59.09 26.44,60.21 28.8,60.21 VR19.P$2
N$43
  Top 0.152: R33.2 VR30.P$2
N$44
  Top 0.508: J16.1 J16.2
  Bottom 0.254: J16.1 75.46,105.44 74.68,104.65 71.43,104.65 D1.A
N$45
  Top 0.152: VR29.P$2 R34.2
N$46
  Top 0.508: J16.9 J16.10
  Bottom 0.254: J16.9 75.92,95.28 73.91,97.28 70.8,97.28 D2.C
N$47  (via drill 0.8 pad 0.8)
  other vias: 59.18,52.07
N$48  (via drill 0.8 pad 0.8)
  other vias: 59.18,71.12
N$49  (via drill 0.8 pad 0.8)
  other vias: 60.45,91.44
N$50
  Top 0.152: VR28.P$2 R35.2
N$51
  Top 0.152: VR27.P$2 R36.2
N$52
  Top 0.152: VR26.P$2 R37.2
N$53
  Top 0.152: R38.2 28.22,78.57 VR25.P$2
N$54
  Top 0.152: VR31.P$2 29.97,96.01 28.83,97.16 24.47,97.16 R39.2
N$55
  Top 0.152: VR32.P$2 R40.2
N$56
  Top 0.152: VR33.P$2 R41.2
N$57
  Top 0.152: VR34.P$2 R42.2
N$59  (via drill 0.8 pad 0.8)
  other vias: 78.23,83.82
N$60
  Top 0.152: VR35.P$2 R43.2
N$61
  Top 0.152: R44.2 VR36.P$2
N$62  (via drill 0.8 pad 0.8)
  Top 0.152: v27.43,98.81 24.42,98.81 R39.1 24.38,98.44 23.61,97.66 23.61,77.98 24.38,77.2 R38.1 24.38,67.27 23.77,66.66 23.77,65.42 24.38,64.81 R32.1 24.38,60.47 23.61,59.69 23.61,47.81 24.38,47.03 R21.1 24.38,42.69 23.61,41.91 23.61,30.03 24.38,29.25 R20.1 24.38,24.91 23.61,24.13 23.61,10.98 24.38,10.2 R9.1
  Bottom 0.152: IC4.2 36.79,95.36 36.34,95.36 36.2,95.49 36.2,97.49 C27.1 R7.2 27.47,98.77 v27.43,98.81
N$63  (via drill 0.8 pad 0.8)
  Top 0.152: R40.1 50.29,79.02 49.12,77.85 49.12,74.94 | 49.12,74.94 50.29,73.77 R37.1 50.29,61.24 49.12,60.07 49.12,57.16 50.29,55.99 R31.1 50.29,43.46 49.12,42.29 49.12,39.38 50.29,38.21 R22.1 50.29,25.68 49.12,24.51 49.12,21.6 50.29,20.43 R19.1 50.29,6.63 49.12,5.46 49.12,3.4 49.26,3.26 49.36,3.26 R10.1 | 49.12,74.94 41.04,74.94 32.22,83.76 31.53,83.76 31.05,83.28 31.05,82.59 36.7,76.93 v36.7,72.77
  Bottom 0.152: 36.83,75.56 IC5.2 | 36.83,75.56 34.67,75.56 34.16,76.07 C28.1 R45.2 | v36.7,72.77 36.7,73.4 36.2,73.9 36.2,74.94 36.83,75.56
N$64  (via drill 0.8 pad 0.8)
  Top 0.152: R41.1 69.34,79.02 68.17,77.85 68.17,74.94 69.34,73.77 R36.1 69.34,61.24 68.17,60.07 68.17,57.16 | 68.17,57.16 69.34,55.99 R30.1 69.34,43.46 68.17,42.29 68.17,39.38 69.34,38.21 R23.1 69.34,25.68 68.17,24.51 68.17,21.6 69.34,20.43 R18.1 69.34,6.63 68.17,5.46 68.17,3.4 68.81,2.76 R11.1 | 68.17,57.16 54.75,57.16 v51.82,54.23 | v41.53,50.55 40.26,50.55 38.35,48.64 37.34,48.64 v34.8,51.18
  Bottom 0.152: IC6.2 35.18,57.79 34.73,57.34 R48.2 32.51,56.79 | 32.51,56.79 C29.1 | v41.53,50.55 42.76,51.78 48.63,51.78 51.09,54.23 v51.82,54.23 | v34.8,51.18 34.8,51.24 31.59,54.45 31.59,55.74 32.51,56.66 32.51,56.79
N$65  (via drill 0.8 pad 0.8)
  Top 0.152: R42.1 88.39,79.02 87.22,77.85 87.22,74.94 88.39,73.77 R35.1 88.39,61.24 87.22,60.07 87.22,57.16 88.39,55.99 R29.1 88.39,43.46 87.22,42.29 87.22,39.38 | 87.22,39.38 88.39,38.21 R24.1 88.39,25.68 87.22,24.51 87.22,21.6 88.39,20.43 R17.1 88.39,6.63 87.22,5.46 87.22,3.4 87.36,3.26 87.65,3.26 R12.1 | 87.22,39.38 73.54,39.38 v70.74,36.58 | v56.9,36.58 v51.44,36.58 | v41.4,31.88 38.91,34.37 38.86,34.37 33.57,39.66 30.52,39.66 v30.23,39.37
  Bottom 0.152: IC7.2 37.41,39.88 36.7,39.88 35.58,38.76 R52.2 C30.1 31.84,39.37 v30.23,39.37 | v70.74,36.58 v56.9,36.58 | v41.4,31.88 43.01,33.49 48.12,33.49 51.21,36.58 v51.44,36.58
N$66  (via drill 0.8 pad 0.8)
  Top 0.152: R43.1 108.71,79.02 107.54,77.85 107.54,74.94 108.71,73.77 R34.1 108.71,61.24 107.54,60.07 107.54,57.16 108.71,55.99 R28.1 108.71,43.46 107.54,42.29 107.54,39.38 108.71,38.21 R25.1 108.71,25.68 107.54,24.51 107.54,21.6 | 107.54,21.6 108.71,20.43 R16.1 108.71,6.63 109.88,5.46 109.88,2.92 R13.1 | 107.54,21.6 92.47,21.6 v89.41,18.54 | v54.48,15.88 53.59,15.88 v51.56,17.91 | v41.27,13.84 36.96,13.84 v30.1,20.7
  Bottom 0.152: 32.51,20.66 C31.1 | 32.51,20.66 R55.2 34.86,21.4 35.69,22.22 IC8.2 | v89.41,18.54 57.15,18.54 v54.48,15.88 | v51.56,17.91 50.07,17.91 49.24,17.07 44.51,17.07 v41.27,13.84 | v30.1,20.7 32.47,20.7 32.51,20.66
N$67  (via drill 0.8 pad 0.8)
  Top 0.152: R44.1 127.76,79.02 128.93,77.85 128.93,74.94 127.76,73.77 R33.1 127.76,61.24 128.93,60.07 128.93,57.16 127.76,55.99 R27.1 127.76,43.46 128.93,42.29 128.93,39.38 127.76,38.21 R26.1 127.76,25.68 128.93,24.51 128.93,21.6 127.76,20.43 R15.1 126.43,18.77 126.43,3.4 126.28,3.24 R14.1 125.22,2.54 123.82,1.4 33.27,1.4 v32.77,1.91
  Bottom 0.152: IC9.2 36.07,6.73 35.18,5.84 C32.1 | 35.21,3.45 35.31,3.26 | 35.21,3.45 C32.1 | R58.2 C32.1 | v32.77,1.91 33.4,1.91 34.29,2.79 34.29,3.3 34.42,3.43 35.2,3.43 35.21,3.45
N$68
  Bottom 0.152: 1.P3 C15.+ 7.97,14.4 Q1.B
N$69
  Bottom 0.152: 2.P3 C16.+ 7.46,32.94 Q2.B
N$70
  Bottom 0.152: 3.P3 C17.+ 7.53,50.72 Q3.B
N$71
  Bottom 0.152: 4.P3 C18.+ 7.72,68.5 Q4.B
N$72
  Bottom 0.152: 5.P3 C19.+ 7.84,86.28 Q5.B
N$73
  Bottom 0.152: Q6.B 11.93,97.71 11.66,97.71 11.38,97.99 C20.+ 6.P3
N$74
  Bottom 0.152: IC4.1 37.49,93.31 R8.2 C27.2 R7.1
N$75  (via drill 0.8 pad 0.8)
  Top 0.152: v38.35,90.93 42.8,90.93 v45.72,93.85
  Bottom 0.152: R8.1 37.68,91.61 v38.35,90.93 | v45.72,93.85 45.72,94.61 44.51,95.82 | 44.51,95.82 44.45,95.88 IC4.6 | 44.51,95.82 44.51,97.69 R50.2
N$76  (via drill 0.8 pad 0.8)
  Bottom 0.152: 46.31,93.27 46.55,93.51 46.55,94.21 45.59,95.17 R50.1 | 46.31,93.27 46.07,93.02 45.38,93.02 43.78,94.61 IC4.7 | C33.+ 137.92,97.79 129.41,89.28 v48.26,89.28 48.26,91.31 46.31,93.27
N$78  (via drill 0.8 pad 0.8)
  Top 0.152: v44.83,72.52 42.29,72.52 v31.88,82.93
  Bottom 0.152: R46.2 45.34,73.02 v44.83,72.52 | v31.88,82.93 R45.1 C28.2 35.26,79.83 35.26,78.56 36.45,77.36 38.73,77.36 38.86,77.23 38.86,75.17 38.73,75.04 38.27,75.04 IC5.1
N$79
  Bottom 0.152: IC5.6 44.54,76.83 | 44.54,76.83 R46.1 | 44.54,76.83 44.54,78.17 R47.2
N$80
  Bottom 0.152: C34.+ 132.72,80.26 129.41,83.57 129.41,87.88 128.32,88.98 52.15,88.98 47.88,84.71 47.88,81.28 47.37,80.77 45.49,80.77 R47.1 44.06,79.39 44.06,77.71 43.93,77.58 41.75,77.58 41.4,77.23 41.4,76.44 41.54,76.31 41.99,76.31 IC5.7
N$83
  Bottom 0.152: C29.2 R48.1 36.43,55.09 R49.2 37.59,56.46 IC6.1
N$84  (via drill 0.8 pad 0.8)
  Top 0.152: v38.61,50.55 38.61,51.31 39.88,52.58 48.1,52.58 48.42,52.25 49.11,52.25 49.6,52.74 49.6,53.43 45.21,57.82 v45.21,62.99
  Bottom 0.152: IC6.6 44.07,59.05 45.17,60.16 R51.2 45.21,60.29 v45.21,62.99 | R49.1 37.59,51.56 v38.61,50.55
N$85
  Bottom 0.152: IC6.7 44.2,57.79 44.87,58.46 R51.1 46.48,59.6 46.48,60.45 47.62,61.6 54.74,61.6 56.64,63.5 56.64,81.15 64.13,88.65 123.7,88.65 135,77.34 135,64.26 137.03,62.23 C35.+
N$86  (via drill 0.8 pad 0.8)
  Top 0.152: v38.35,36.7 39.88,36.7 40.39,37.21 40.39,44.7 v41.53,45.85
  Bottom 0.152: C30.2 R52.1 | R52.1 35.86,37.06 IC7.1 | R52.1 38,37.06 v38.35,36.7 | v41.53,45.85 45.44,45.85 R53.2
N$87
  Bottom 0.152: IC7.6 44.55,41.28 R54.2 R53.1
N$88
  Bottom 0.152: C36.+ 47.88,44.45 46.48,43.05 46.48,41.5 45.54,40.56 | 45.54,40.56 R54.1 | IC7.7 44.32,40.01 44.7,40.39 45.36,40.39 45.54,40.56
N$90  (via drill 0.8 pad 0.8)
  Top 0.152: v42.04,27.3 41.02,27.3 40.39,26.67 40.39,20.57 v38.61,18.92
  Bottom 0.152: C31.2 R55.1 36.87,18.96 | 36.87,18.96 37.47,19.56 37.47,20.89 IC8.1 | R56.2 42.82,28.09 v42.04,27.3 | 36.87,18.96 38.57,18.96 v38.61,18.92
N$91
  Bottom 0.152: IC8.6 44.07,23.5 45.36,24.79 R57.2 R56.1
N$92
  Bottom 0.152: IC8.7 45.09,22.22 45.47,22.61 R57.1 46.61,24.23 46.61,28.19 54.99,36.58 54.99,41.91 57.23,44.15 132.26,44.15 144.72,31.68 144.72,29.51 144.13,28.93 C37.+
N$94  (via drill 0.8 pad 0.8)
  Top 0.152: v40.13,4.19 v44.83,4.19
  Bottom 0.152: 38.83,4.16 38.86,4.13 38.86,2.29 38.35,1.78 37.5,1.78 | 38.83,4.16 IC9.1 | 38.83,4.16 40.1,4.16 v40.13,4.19 | R59.2 46.77,5.6 46.76,5.6 45.35,4.19 v44.83,4.19 | 37.5,1.78 R58.1 | C32.2 R58.1 | R58.1 37.5,1.78
N$95
  Bottom 0.152: IC9.6 44.2,8 44.98,8.79 R60.2 R59.1
N$96
  Bottom 0.152: IC9.7 44.58,6.73 44.93,7.09 R60.1 46.89,8 50.55,8 52.7,10.29 52.7,15.49 56.49,19.03 56.49,31.1 55.46,32.13 55.46,41.95 57.35,43.84 132.08,43.84 134.87,41.05 134.87,10.16 137.41,7.62 C38.+
N$105  (via drill 0.8 pad 0.8)
  other vias: 78.23,71.12
N$106  (via drill 0.8 pad 0.8)
  other vias: 78.23,52.07
N$107  (via drill 0.8 pad 0.8)
  other vias: 78.23,41.91
N$108  (via drill 0.8 pad 0.8)
  other vias: 78.23,36.83
N$109  (via drill 0.8 pad 0.8)
  other vias: 78.23,22.86
N$110  (via drill 0.8 pad 0.8)
  other vias: 78.23,15.24
N$111  (via drill 0.8 pad 0.8)
  other vias: 98.55,11.43
N$112  (via drill 0.8 pad 0.8)
  other vias: 141.73,91.44
N$113  (via drill 0.8 pad 0.8)
  other vias: 118.87,83.82
N$114  (via drill 0.8 pad 0.8)
  other vias: 118.87,66.04
N$115  (via drill 0.8 pad 0.8)
  other vias: 118.87,48.26
N$116  (via drill 0.8 pad 0.8)
  other vias: 118.87,30.48
N$117  (via drill 0.8 pad 0.8)
  other vias: 98.55,30.48
N$118  (via drill 0.8 pad 0.8)
  other vias: 98.55,48.26
N$119  (via drill 0.8 pad 0.8)
  other vias: 98.55,66.04
N$120  (via drill 0.8 pad 0.8)
  other vias: 117.6,101.6
N$121  (via drill 0.8 pad 0.8)
  other vias: 98.55,101.6
N$122  (via drill 0.8 pad 0.8)
  other vias: 98.55,83.82
N$123  (via drill 0.8 pad 0.8)
  other vias: 59.18,11.43
N$124  (via drill 0.8 pad 0.8)
  other vias: 37.59,105.41
N$125  (via drill 0.8 pad 0.8)
  other vias: 10.92,76.2
N$126  (via drill 0.8 pad 0.8)
  other vias: 10.92,92.71
N$127  (via drill 0.8 pad 0.8)
  other vias: 10.92,58.42
N$128  (via drill 0.8 pad 0.8)
  other vias: 10.92,40.64
N$129  (via drill 0.8 pad 0.8)
  other vias: 10.92,21.59
VCC  (via drill 0.8 pad 0.8)
  Top 0.254: v40.39,7.11 26.76,7.11 25.05,5.4 23.72,5.4 23.55,5.57 23.55,9.69 L1.A 21.83,30.45 L2.A L3.A L4.A L5.A 21.86,101.58 L6.A
  Bottom 0.254: 40.39,94.49 41.4,93.47 42.61,93.47 IC4.8 42.73,91.21 C13.1 | 40.39,94.49 40.39,75.95 | 40.39,75.95 41.91,74.42 42.61,74.42 IC5.8 42.73,72.03 C21.1 | 40.39,75.95 40.39,58.17 | 40.39,58.17 41.91,56.64 42.61,56.64 IC6.8 42.73,54.45 C9.1 | 40.39,58.17 40.39,40.39 | 40.39,40.39 41.91,38.86 42.61,38.86 IC7.8 42.73,36.03 C11.1 | 40.39,40.39 40.39,22.61 | 40.39,22.61 41.91,21.08 42.61,21.08 IC8.8 C22.1 | 40.39,22.61 v40.39,7.11 41.91,5.59 42.61,5.59 IC9.8 42.73,3.58 C23.1 | D1.C 65.34,104.58 63.75,106.17 59.13,106.17 C1.+ 42.86,104.33 40.38,101.84 40.38,94.5 40.39,94.49
VEE
  Bottom 0.254: 39.97,101.18 39.12,100.33 37.81,100.33 C14.2 37.59,97.21 IC4.4 | 39.97,101.18 39.97,102.01 39.98,102.02 42.69,104.74 43.03,104.74 | 39.97,101.18 39.97,80.54 | 39.97,80.54 IC5.4 C26.2 | 39.97,80.54 39.97,65.22 | 39.97,65.22 C10.2 37.59,60.39 IC6.4 | 39.97,65.22 39.97,47.95 | 39.97,47.95 C12.2 37.59,42.61 IC7.4 | 39.97,47.95 39.97,29.98 | 39.97,29.98 C25.2 37.59,24.82 IC8.4 | 39.97,29.98 39.97,11.71 IC9.4 37.59,9.33 C24.2 | C2.- 59.2,99.06 64.52,99.06 66.23,97.35 D2.A 66.93,101.73 69.09,103.89 69.09,105.66 68.07,106.68 59.07,106.68 57.7,105.31 54.51,105.31 53.94,104.74 43.03,104.74 | 43.03,104.74

### Text on the board
Top: MATRIG MIXER REV.02 // RODNOK*2017 (CC)
tNames: GET SHIT DONE! | *All TOP resistors are 5.6k
bNames: RED